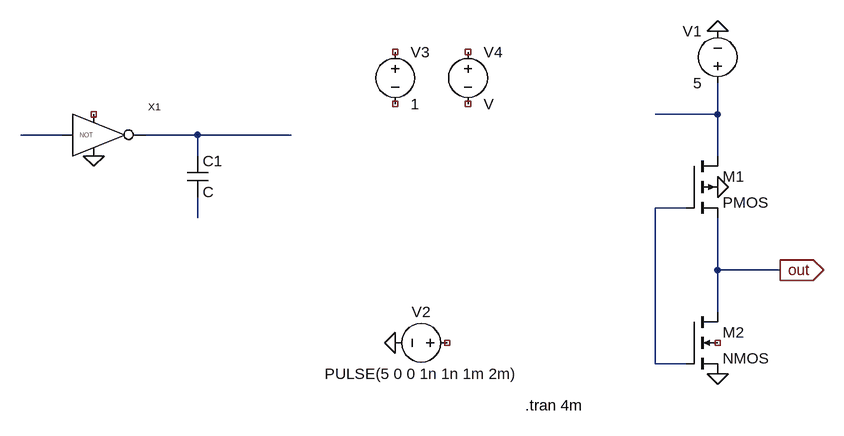
[diagram p0: schematic inverter_1.asc]
inverter_1.asc, the LTspice schematic file:
Version 4
SHEET 1 880 680
WIRE 304 -16 304 -64
WIRE 304 -16 208 -16
WIRE -704 16 -768 16
WIRE -496 16 -576 16
WIRE -352 16 -496 16
WIRE -496 48 -496 16
WIRE 304 48 304 -16
WIRE 256 128 208 128
WIRE -496 144 -496 112
WIRE 304 224 304 144
WIRE 400 224 304 224
WIRE 304 288 304 224
WIRE 208 368 208 128
WIRE 256 368 208 368
FLAG 304 96 0
FLAG 304 384 0
FLAG 400 224 out
IOPIN 400 224 Out
FLAG 304 -144 0
FLAG -192 336 0
FLAG -656 48 0
SYMBOL pmos4 256 48 R0
SYMATTR InstName M1
SYMBOL nmos4 256 288 R0
SYMATTR InstName M2
SYMBOL voltage 304 -48 R180
WINDOW 0 24 96 Left 2
WINDOW 3 24 16 Left 2
WINDOW 123 0 0 Left 0
WINDOW 39 0 0 Left 0
SYMATTR InstName V1
SYMATTR Value 5
SYMBOL voltage -96 336 R90
WINDOW 0 -32 56 VBottom 2
WINDOW 3 32 56 VTop 2
WINDOW 123 0 0 Left 0
WINDOW 39 0 0 Left 0
SYMATTR InstName V2
SYMATTR Value PULSE(5 0 0 1n 1n 1m 2m)
SYMBOL NOT4 -640 32 R0
SYMATTR InstName X1
SYMBOL cap -512 48 R0
SYMATTR InstName C1
SYMBOL voltage -192 -128 R0
WINDOW 123 0 0 Left 0
WINDOW 39 0 0 Left 0
SYMATTR InstName V3
SYMATTR Value 1
SYMBOL voltage -80 -128 R0
SYMATTR InstName V4
TEXT 8 432 Left 2 !.tran 4m

The netlist it stands for:
* inverter_1.asc
M1 N001 N004 out 0 PMOS
M2 out N004 0 NC_01 NMOS
V1 N001 0 5
V2 NC_02 0 PULSE(5 0 0 1n 1n 1m 2m)
XX1 N002 NC_03 0 N003 NOT4  ; pins A VH VL OUT
C1 N003 N005 C
V3 NC_04 NC_05 1
V4 NC_06 NC_07 V
.model NMOS NMOS
.model PMOS PMOS
.lib standard.mos
.tran 4m
.backanno
.end